# EAGLE design mcu_side (EAGLE 9.6.0)
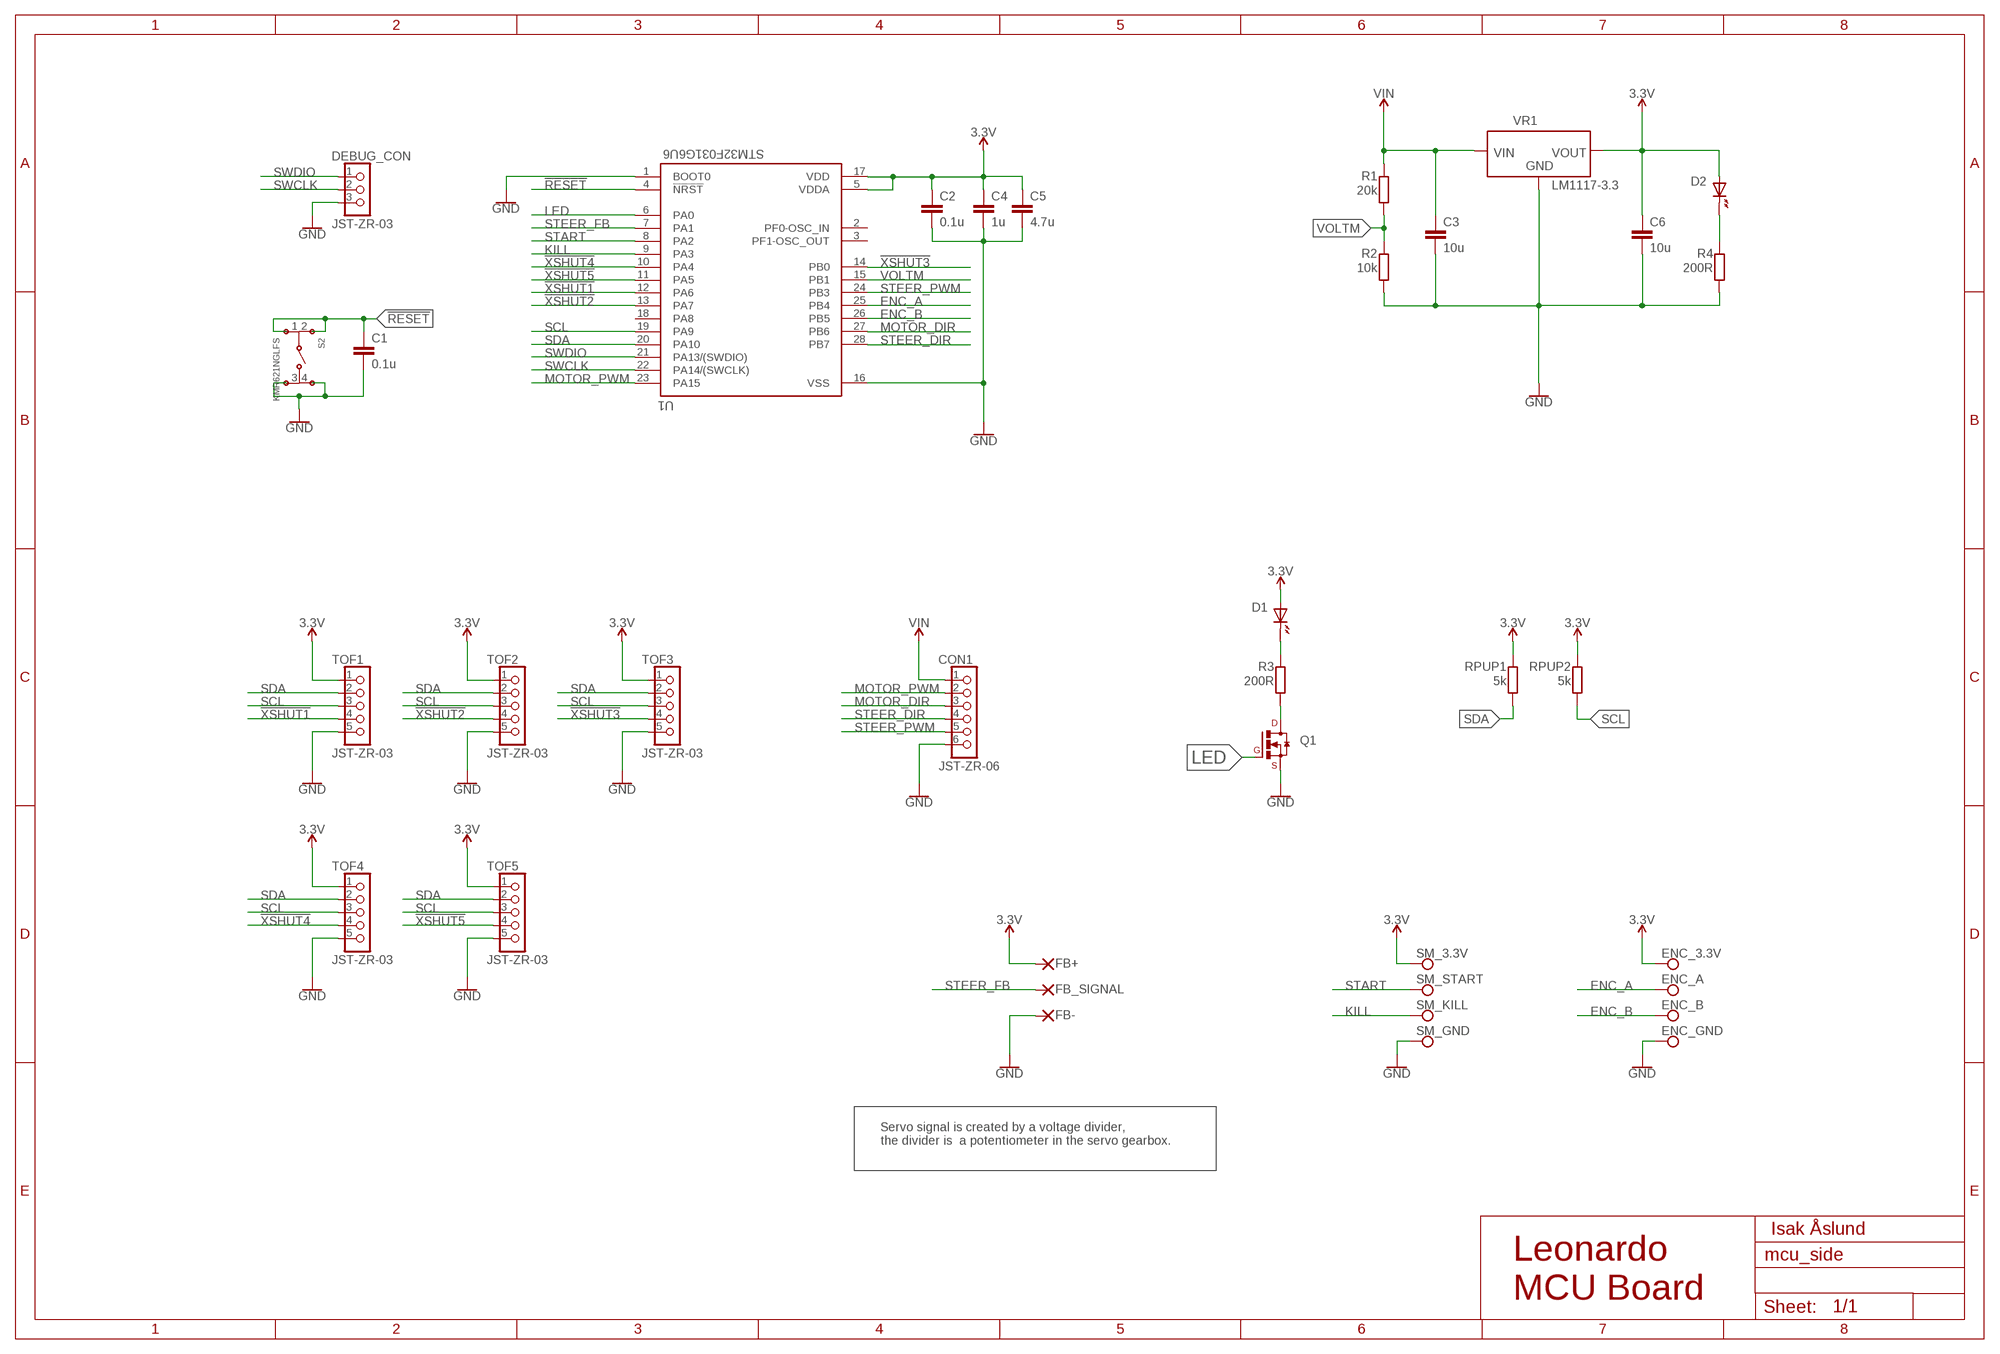
[diagram p0: schematic, sheet 1]

## Parts
C1  0.1u  C0603  [C0603]
C2  0.1u  C0603  [C0603]
C3  10u  C1206  [C1206]
C4  1u  C0603  [C0603]
C5  4.7u  C0603  [C0603]
C6  10u  C1206  [C1206]
CON1  JST-ZR-06  ZR_B6B-ZR  [B6B-ZR]
D1  CHIP-LED0603  [CHIP-LED0603]
D2  CHIP-LED0603  [CHIP-LED0603]
DEBUG_CON  JST-ZR-03  ZR_B3B-ZR  [B3B-ZR]
ENC_3.3V  PAD-SMD-ROUND-1.27PAD  [PAD.03X.05]
ENC_A  PAD-SMD-ROUND-1.27PAD  [PAD.03X.05]
ENC_B  PAD-SMD-ROUND-1.27PAD  [PAD.03X.05]
ENC_GND  PAD-SMD-ROUND-1.27PAD  [PAD.03X.05]
FB+  SMD2  [SMD1,27-2,54]
FB-  SMD2  [SMD1,27-2,54]
FB_SIGNAL  SMD2  [SMD1,27-2,54]
Q1  BSS138LT3G  [SOT23]
R1  20k  R0603  [R0603]
R2  10k  R0603  [R0603]
R3  200R  R0603  [R0603]
R4  200R  R0603  [R0603]
RPUP1  5k  R0603  [R0603]
RPUP2  5k  R0603  [R0603]
S2  KMR621NGLFS  [KMR621NGLFS]
SM_3.3V  PAD-SMD-ROUND-1.27PAD  [PAD.03X.05]
SM_GND  PAD-SMD-ROUND-1.27PAD  [PAD.03X.05]
SM_KILL  PAD-SMD-ROUND-1.27PAD  [PAD.03X.05]
SM_START  PAD-SMD-ROUND-1.27PAD  [PAD.03X.05]
TOF1  JST-ZR-03  ZR_B5B-ZR  [B5B-ZR]
TOF2  JST-ZR-03  ZR_B5B-ZR  [B5B-ZR]
TOF3  JST-ZR-03  ZR_B5B-ZR  [B5B-ZR]
TOF4  JST-ZR-03  ZR_B5B-ZR  [B5B-ZR]
TOF5  JST-ZR-03  ZR_B5B-ZR  [B5B-ZR]
U1  STM32F031G6U6  [QFN50P400X400X60-28N]
VR1  LM1117-3.3  [SOT230P700X180-4]

## Nets
3.3V: C2.1 C4.1 C5.1 C6.1 D1.A D2.A ENC_3.3V.P$1 FB+.1(P) RPUP1.1 RPUP2.1 SM_3.3V.P$1 TOF1.1 TOF2.1 TOF3.1 TOF4.1 TOF5.1 U1.5(VDDA) U1.17(VDD) VR1.2(VOUT) VR1.4(VOUT)
!RESET: C1.1 S2.1 S2.2 U1.4(!NRST)
!XSHUT1: TOF1.4 U1.12(PA6)
!XSHUT2: TOF2.4 U1.13(PA7)
!XSHUT3: TOF3.4 U1.14(PB0)
!XSHUT4: TOF4.4 U1.10(PA4)
!XSHUT5: TOF5.4 U1.11(PA5)
ENC_A: ENC_A.P$1 U1.25(PB4)
ENC_B: ENC_B.P$1 U1.26(PB5)
GND: C1.2 C2.2 C3.2 C4.2 C5.2 C6.2 CON1.6 DEBUG_CON.3 ENC_GND.P$1 FB-.1(P) Q1.2(S) R2.2 R4.2 S2.3 S2.4 SM_GND.P$1 TOF1.5 TOF2.5 TOF3.5 TOF4.5 TOF5.5 U1.1(BOOT0) U1.16(VSS) VR1.1(GND)
KILL: SM_KILL.P$1 U1.9(PA3)
LED: Q1.1(G) U1.6(PA0)
MOTOR_DIR: CON1.3 U1.27(PB6)
MOTOR_PWM: CON1.2 U1.23(PA15)
N$4: D1.C(K) R3.1
N$5: D2.C(K) R4.1
N$17: Q1.3(D) R3.2
SCL: RPUP2.2 TOF1.3 TOF2.3 TOF3.3 TOF4.3 TOF5.3 U1.19(PA9)
SDA: RPUP1.2 TOF1.2 TOF2.2 TOF3.2 TOF4.2 TOF5.2 U1.20(PA10)
START: SM_START.P$1 U1.8(PA2)
STEER_DIR: CON1.4 U1.28(PB7)
STEER_FB: FB_SIGNAL.1(P) U1.7(PA1)
STEER_PWM: CON1.5 U1.24(PB3)
SWCLK: DEBUG_CON.2 U1.22(PA14/(SWCLK))
SWDIO: DEBUG_CON.1 U1.21(PA13/(SWDIO))
VIN: C3.1 CON1.1 R1.1 VR1.3(VIN)
VOLTM: R1.2 R2.1 U1.15(PB1)
Unconnected: U1.2(PF0-OSC_IN) U1.3(PF1-OSC_OUT) U1.18(PA8)

## Notes on the sheet
- Servo signal is created by a voltage divider,
  the divider is  a potentiometer in the servo gearbox.
- Isak Åslund
- Leonardo
  MCU Board

## Library data of the parts
C1 C2 C4 C5 = CASE-RCL:C0603: Standard Chip CAPACITOR 0605 (1608 Metric) Description: Standard Chip CAPACITOR 0605 (1608 Metric)
C3 C6 = CASE-RCL:C1206: Standard Chip CAPACITOR 1206 (3216 Metric) Description: Standard Chip CAPACITOR 1206 (3216 Metric)
CON1 = CASE-JST:ZR_B6B-ZR: JST ZR Connector, through hole, 6 pin, top entry Description: JST ZR connector with 1.5 mm pitch, through hole version, 6 pin, top entry. Links: Datasheet <http://www.jst-mfg.com/product/pdf/eng/eZH.pdf>
D1 D2 = CASE-LED:CHIP-LED0603: CHIP-LED0603 (SMD) Description: Standard 0603 SMD CHIP-LED
DEBUG_CON = CASE-JST:ZR_B3B-ZR: JST ZR Connector, through hole, 3 pin, top entry Description: JST ZR connector with 1.5 mm pitch, through hole version, 3 pin, top entry. Links: Datasheet <http://www.jst-mfg.com/product/pdf/eng/eZH.pdf>
ENC_3.3V ENC_A ENC_B ENC_GND SM_3.3V SM_GND SM_KILL SM_START = Isaks Bibliotek:PAD-SMD-ROUND-1.27: SMD PAD Bare copper pad, 1.27x1.27 mm (0.05x0.05")
FB+ FB- FB_SIGNAL = wirepad:SMD2: SMD PAD
Q1 = CASE-Transistors:BSS138LT3G: BSS138LT3G N-Channel Mosfet (SOT-23) Description: BSS138LT3G N-Channel Mosfet in a SOT-23 package Links: BSS138LT3G <http://www.farnell.com/datasheets/2353875.pdf?_ga=2.38865383.510093211.1546607516-411290609.1543318711>
R1-R4 RPUP1 RPUP2 = CASE-RCL:R0603: Standard Chip RESISTOR 0603 (1608 Metric) Description: Standard Chip RESISTOR 0603 (1608 Metric)
S2 = CASE-Switches:KMR621NGLFS: C&K KMR621NG LFS Tactile SPST switch (SMD) Description: C&K KMR621NG LFS Tactile SPST switch SMD package. Links: KMR621NG LFS <http://www.farnell.com/datasheets/2706242.pdf?_ga=2.40597409.2071720333.1546461288-1112771566.1525371275>
TOF1-TOF5 = CASE-JST:ZR_B5B-ZR: JST ZR Connector, through hole, 5 pin, top entry Description: JST ZR connector with 1.5 mm pitch, through hole version, 5 pin, top entry. Links: Datasheet <http://www.jst-mfg.com/product/pdf/eng/eZH.pdf>
U1 = Isaks Bibliotek:STM32F031G6U6: Mainstream ARM Cortex-M0 Access line MCU with 32 Kbytes Flash, 48 MHz CPU, motor control; AVAILABILITY: Unavailable; DESCRIPTION: ARM® Cortex®-M0 STM32F0 Microcontroller IC 32-Bit 48MHz 32KB _32K x 8_ FLASH; MF: STMicroelectronics; MP: STM32F031G6U6; PACKAGE: UFQFN-28 STMicroelectronics; PRICE: None
VR1 = Isaks Bibliotek:LM1117-3.3: LM1117 Description: Fixed output voltage regulator Out: 3.3V, 800mA Link: Datasheet <https://datasheet.lcsc.com/szlcsc/Texas-Instruments-TI-LM1117IMPX-3-3-NOPB_C23984.pdf> LCSC.nr: C23984; IMAX: 800mA; VIN_MAX: 20; VOUT: 3.3V

## Board
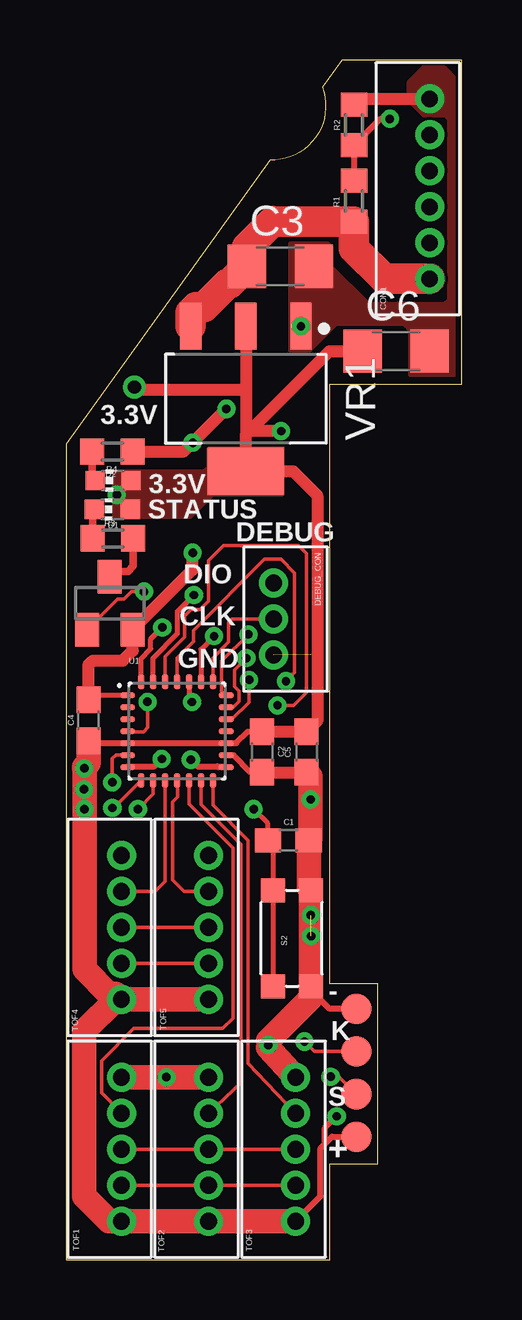
[diagram p1: board, top side]
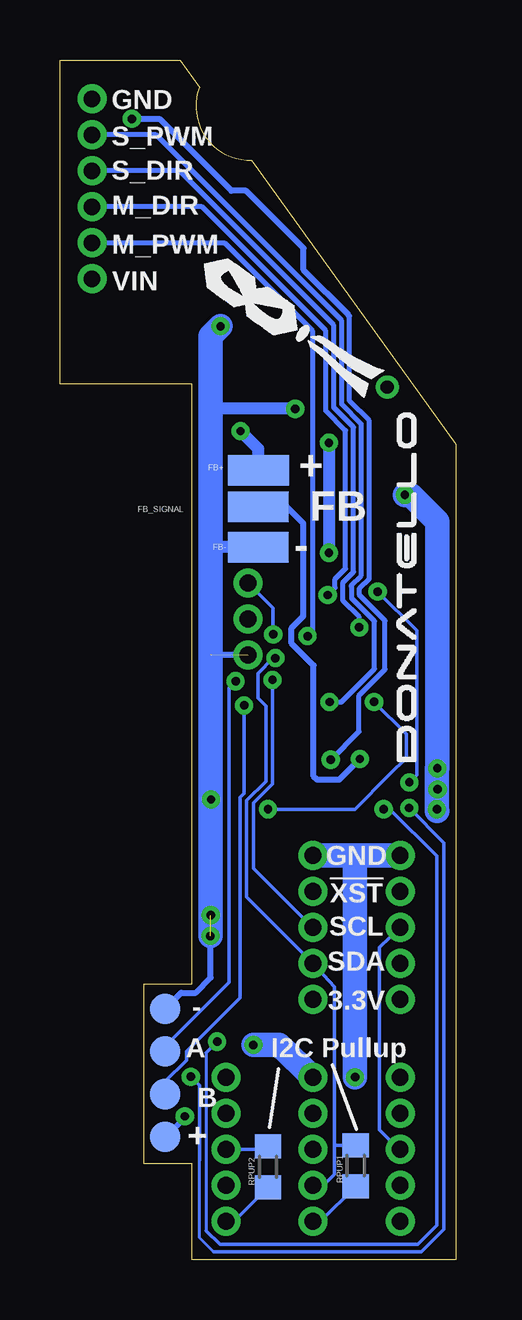
[diagram p2: board, bottom side, seen from below]

Size 16.5 x 50 mm. Coordinates in mm from the lower left corner, seen from the top.
Outline: 0,0 11,0 11,4 13,4 13,11.5 11,11.5 11,36.5 16.5,36.5 16.5,50 11.5,50 10.68,48.86 arc-113 8.5,45.83 0,34 0,0
Copper layers (1*16): Top 0.035mm / dielectric 1.5mm / Bottom 0.035mm
Design rules "default *": minimum track width 5mil, minimum drill 0.2mm, track to track 5mil, track to pad 6mil, pad to pad 6mil, via to via 6mil, smd to smd 6mil, copper to edge 10mil, drill to drill 6mil, minimum pad ring 10mil, minimum via ring 8mil, stop-mask expansion 4mil, vias tented up to drill 20mil, thermal gap 10mil

### Footprints (pad centres in the part's own frame; a part is rotated, then mirrored left to right if it is on the bottom)
C0603 = smd 1.1 x 1: 1 -0.85,0; 2 0.85,0
C1206 = smd 1.6 x 1.8: 1 -1.4,0; 2 1.4,0
B6B-ZR = drill 0.7: 1 -3.75,0; 2 -2.25,0; 3 -0.75,0; 4 0.75,0; 5 2.25,0; 6 3.75,0
CHIP-LED0603 = smd 0.8 x 0.8: A 0,-0.75; C 0,0.75
B3B-ZR = drill 0.7: 1 -1.5,0; 2 0,0; 3 1.5,0
PAD.03X.05 = smd 1.27 x 1.27: P$1 0,0
SMD1,27-2,54 = smd 1.27 x 2.54: 1 0,0
SOT23 = smd 1 x 1.4: 1 -0.95,-1.1; 2 0.95,-1.1; 3 0,1.1
R0603 = smd 1 x 1.1: 1 -0.85,0; 2 0.85,0
KMR621NGLFS = smd 1 x 1: 1 -2,-0.8; 2 2,-0.8; 3 -2,0.8; 4 2,0.8
B5B-ZR = drill 0.7: 1 -3,0; 2 -1.5,0; 3 0,0; 4 1.5,0; 5 3,0
QFN50P400X400X60-28N = smd 0.62 x 0.27: 1 -2.055,1.5; 2 -2.055,1; 3 -2.055,0.5; 4 -2.055,0; 5 -2.055,-0.5; 6 -2.055,-1; 7 -2.055,-1.5; 15 2.055,-1.5; 16 2.055,-1; 17 2.055,-0.5; 18 2.055,0; 19 2.055,0.5; 20 2.055,1; 21 2.055,1.5 | smd 0.27 x 0.62: 8 -1.5,-2.055; 9 -1,-2.055; 10 -0.5,-2.055; 11 0,-2.055; 12 0.5,-2.055; 13 1,-2.055; 14 1.5,-2.055; 22 1.5,2.055; 23 1,2.055; 24 0.5,2.055; 25 0,2.055; 26 -0.5,2.055; 27 -1,2.055; 28 -1.5,2.055
SOT230P700X180-4 = smd 1.965 x 0.889: 1 -3.023,2.3; 2 -3.023,0; 3 -3.023,-2.3 | smd 1.965 x 3.189: 4 3.023,0

### Placement (x,y rotation side)
C1  9.27,17.48 0 top
C2  8.18,21.16 270 top
C3  8.94,41.4 0 top
C4  0.94,22.48 90 top
C5  10.03,21.16 270 top
C6  13.77,37.86 0 top
CON1  15.16,44.63 90 top
D1  1.93,31.27 90 top
D2  1.96,32.47 90 top
DEBUG_CON  8.66,26.7 270 top
ENC_3.3V  12.11,5.12 0 bottom
ENC_A  12.11,8.67 0 bottom
ENC_B  12.11,6.9 0 bottom
ENC_GND  12.11,10.45 0 bottom
FB+  8.22,32.9 270 bottom
FB-  8.23,29.69 270 bottom
FB_SIGNAL  8.23,31.37 270 bottom
Q1  1.83,27.36 0 top
R1  12.01,44.12 90 top
R2  12.01,47.29 90 top
R3  1.95,30.06 0 top
R4  1.93,33.68 0 top
RPUP1  4.17,3.91 90 bottom
RPUP2  7.82,3.86 90 bottom
S2  9.42,13.39 270 top
SM_3.3V  12.1,5.12 0 top
SM_GND  12.1,10.45 0 top
SM_KILL  12.1,8.67 0 top
SM_START  12.1,6.9 0 top
TOF1  2.31,4.6 90 top
TOF2  5.94,4.6 90 top
TOF3  9.58,4.6 90 top
TOF4  2.31,13.84 90 top
TOF5  5.94,13.84 90 top
U1  4.62,22.02 0 top
VR1  7.5,35.88 270 top

### Tracks (layer width: path | path; a pad name or v marks a point on that pad's centre or on a via)
3.3V  (via drill 0.35, 0.55)
  Top 0.203: C4.1 1.05,21.52
  Top 0.254: C2.1 7.58,22.01 7.09,21.52 U1.17 U1.5 1.05,21.52 | 2.71,31.3 D1.A | TOF3.1 10.62,2.64 10.62,4.64 10.81,4.82 | 10.81,4.82 11.1,5.12 SM_3.3V.P$1 | 10.81,4.82 10.81,5.49 v11.29,5.97
  Top 0.305: D2.A v2.11,31.87 2.68,31.3 D1.A
  Top 0.508: C2.1 C5.1 10.48,22.46 10.48,31.84 9.47,32.86 VR1.4 | VR1.4 7.65,32.86 7.26,32.47 | VR1.4 7.5,34.38 | C6.1 10.98,37.86 7.65,34.53 | VR1.2 7.5,36.3 | 7.5,36.3 7.5,34.38 | v8.97,34.53 7.65,34.53 | 7.65,34.53 7.5,34.38 | 7.5,36.3 7.45,36.24 2.96,36.24 v2.85,36.36
  Top 1.016: TOF3.1 TOF2.1 TOF1.1 1.81,1.6 0.76,2.64 0.76,9.53 2.08,10.84 TOF4.1 | TOF4.1 TOF5.1 | TOF4.1 2.08,11.08 1.79,11.08 0.78,12.09 v0.78,18.77 0.78,20.46 v0.76,20.47 0.76,20.52 0.94,20.7 C4.1
  Bottom 0.152: RPUP1.1 5.63,1.6 TOF2.1 | RPUP2.1 9.24,1.6 TOF3.1 | v0.75,19.6 0.76,18.69
  Bottom 0.254: v11.29,5.97 11.29,5.93 ENC_3.3V.P$1
  Bottom 0.508: FB+.1 8.22,33.78 v8.97,34.53
  Bottom 1.016: 0.76,18.69 0.78,18.71 v0.78,18.77 0.78,20.46 v0.76,20.47 0.76,30.76 1.87,31.87 v2.11,31.87
  pour Top (no thermals): 1.95,32.88 1.95,30.93 5.22,30.93 6.15,31.86 9.03,31.86 9.09,31.92 9.09,33.84 5.94,33.84 5.91,33.81 5.91,33.06 5.73,32.88
!RESET  (via drill 0.35)
  Top 0.152: v3.4,23.24 3.4,22.17 3.23,22 2.59,22 U1.4
  Top 0.203: v7.82,18.77 8.42,18.17 C1.1 8.62,17.27 S2.1 S2.2
  Bottom 0.152: v7.82,18.77 4.19,18.77 2.75,20.21 2.06,20.9 2.06,21.9 v3.4,23.24
!XSHUT1
  Top 0.152: U1.12 5.13,19.96 5.13,18.99 6.96,17.16 6.96,10.06 6.53,9.63 2.82,9.63 1.48,8.29 1.48,6.96 TOF1.4
!XSHUT2
  Top 0.152: U1.13 5.62,18.96 7.29,17.3 7.29,7.37 TOF2.4
!XSHUT3
  Top 0.152: TOF3.4 7.59,8.18 7.59,17.48 6.12,18.95 U1.14
!XSHUT4
  Top 0.152: U1.10 4.12,15.76 3.71,15.34 TOF4.4
!XSHUT5
  Top 0.152: TOF5.4 4.93,15.34 4.45,15.83 4.45,19.07 4.65,19.28 4.65,19.94 U1.11
ENC_A  (via drill 0.35)
  Top 0.152: U1.25 4.62,25.08 5.31,25.77 5.31,26.22 8.28,29.19 8.97,29.19 9.54,28.62 9.54,24.47 v9.17,24.1
  Bottom 0.152: v9.17,24.1 9.45,23.82 9.45,11.55 12.11,8.89 ENC_A.P$1
ENC_B  (via drill 0.35)
  Top 0.152: U1.26 4.12,25.13 4.95,25.96 4.95,26.82 5.22,27.09 5.58,27.09 5.94,27.45 5.94,29.13 6.57,29.76 9.7,29.76 10.03,29.43 10.03,23.65 9.48,23.1 v8.82,23.1
  Bottom 0.152: v8.82,23.1 8.82,19.42 8.99,19.25 8.99,10.9 11.22,8.67 11.22,8.31 12.11,7.42 ENC_B.P$1
GND  (via drill 0.35)  (2 unrouted)
  Top 0.203: C4.2 1.13,23.52 U1.1
  Top 0.254: CON1.6 | U1.16 6.99,21.02 7.7,20.31 C2.2 | SM_GND.P$1 10.98,10.45 10.22,11.21
  Top 0.508: C2.2 C5.2 | 8.43,8.84 v8.43,8.94 8.43,9.12 | 10.22,10.91 10.22,11.21 S2.4 | 10.12,15.49 S2.3 | C4.2 0.94,24.79 1.12,24.97 2.36,24.97 2.78,25.39 Q1.2 5.28,28.76 v5.28,29.46 | v6.69,35.46 v5.28,34.05 4.91,33.68 R4.2 | R2.2 12.26,48.39 CON1.6
  Top 1.016: TOF3.5 8.43,8.84 | 10.22,10.91 8.43,9.12 | S2.4 v10.22,13.49 S2.3 | 10.12,15.49 C1.2 10.2,17.55 v10.2,19.18 10.2,20.14 C5.2 | TOF1.5 v4.19,7.6 TOF2.5
  Bottom 0.254: ENC_GND.P$1 11.44,11.12 10.84,11.12 10.21,11.75 v10.21,13.5 | DEBUG_CON.3 10.2,25.2 10.21,25.21
  Bottom 0.508: FB-.1 9.94,29.69 10.22,29.97 | v5.28,34.05 v5.28,29.46 | v6.69,35.46 10.18,35.46 10.21,35.43
  Bottom 1.016: v8.43,8.94 7.36,8.94 TOF2.5 | TOF4.5 4.19,16.84 | 4.19,16.84 TOF5.5 | 10.21,25.21 v10.21,13.5 v10.22,13.49 | 10.22,25.22 10.22,29.97 10.22,33.39 10.21,33.4 10.21,35.43 10.21,38.49 VR1.1 | 4.19,16.84 v4.19,7.6
  other vias: 10.21,14.35 9.8,38.9
  pour Top (no thermals): 9.33,42.36 9.33,37.89 10.17,37.89 11.28,39 14.07,39 14.34,38.73 14.34,36.87 16.32,36.87 16.35,36.9 16.35,49.14 15.78,49.71 14.91,49.71 14.28,49.08 14.28,48.3 14.91,47.67 15.81,47.67 15.96,47.52 15.96,40.02 15.78,39.84 12.63,39.84 11.1,41.37 11.1,42.18 10.92,42.36
KILL  (via drill 0.35)
  Top 0.152: U1.9 3.62,19.4 v3,18.77 | v9.94,9.08 10.35,8.67 SM_KILL.P$1
  Bottom 0.127: 10.4,8.62 10.4,1.21
  Bottom 0.152: v3,18.77 2.74,18.77 0.79,16.82 0.79,1.42 1.57,0.64 9.83,0.64 10.4,1.21 | v9.94,9.08 10.4,8.62
LED  (via drill 0.35)
  Top 0.152: Q1.1 2.15,27.53 2.42,27.53 2.73,27.84 v3.25,27.84 | v1.93,19.89 1.93,20.88 2.08,21.03 2.09,21.02 U1.6
  Bottom 0.152: v3.25,27.84 1.62,26.21 1.62,20.2 v1.93,19.89
MOTOR_DIR  (via drill 0.35)
  Top 0.203: v5.33,27.7 4.65,27.01 4.65,26.08 3.62,25.06 U1.27
  Bottom 0.203: CON1.3 10.58,43.88 5.41,38.71 5.41,35.38 4.59,34.56 4.59,28.79 5.02,28.36 5.02,28.01 v5.33,27.7
MOTOR_PWM  (via drill 0.35)
  Top 0.203: v6.17,25.99 5.62,25.44 U1.23
  Bottom 0.203: CON1.2 9.64,42.38 5.97,38.71 5.97,26.19 v6.17,25.99
N$4
  Top 0.305: R3.1 1.1,31.2 D1.C
N$5
  Top 0.305: R4.1 1.08,32.59 D2.C
N$17
  Top 0.305: Q1.3 2.05,28.68 2.58,28.68 2.8,28.9 R3.2
SCL  (via drill 0.35)
  Top 0.152: TOF1.3 TOF2.3 TOF3.3 | TOF4.3 TOF5.3 | v7.63,24.16 7.63,23.23 6.93,22.52 U1.19
  Bottom 0.152: TOF4.3 3.17,13.01 3.17,5.41 2.36,4.6 TOF1.3 | RPUP2.2 7.94,4.6 TOF3.3 | v7.63,24.16 7.63,19.82 8.43,19.02 8.43,16.31 5.96,13.84 TOF5.3
SDA  (via drill 0.35)
  Top 0.152: TOF1.2 TOF2.2 TOF3.2 | TOF4.2 TOF5.2 | U1.20 6.99,23.03 7.22,23.26 7.22,23.7 7.02,23.89 7.02,24.57 v7.51,25.07
  Bottom 0.152: 5.05,4.76 5.05,11.37 TOF5.2 8.71,15.11 8.71,19.14 7.91,19.93 7.91,23.07 8.24,23.4 8.24,24.43 7.6,25.07 v7.51,25.07 | 5.05,4.76 5.05,3.56 5.51,3.1 TOF2.2 | RPUP1.2 5.05,4.76
START  (via drill 0.35)
  Top 0.152: U1.8 1.98,18.82 v1.93,18.82 | SM_START.P$1 11.38,7.62 v11.04,7.62
  Bottom 0.127: 10.1,0.33 10.68,0.92 10.68,4.13
  Bottom 0.152: v1.93,18.82 0.48,17.37 0.48,1.27 1.42,0.33 10.1,0.33 | 10.68,4.13 10.68,7.26 v11.04,7.62
STEER_DIR  (via drill 0.35)
  Top 0.203: v4.01,26.35 3.53,25.86 3.53,25.45 3.12,25.04 U1.28
  Bottom 0.203: CON1.4 11.51,45.38 5.08,38.94 5.08,35.52 4.26,34.7 4.26,28.66 4.69,28.23 4.69,27.45 4.01,26.77 v4.01,26.35
STEER_FB  (via drill 0.35)
  Top 0.254: v3.99,20.86 3.68,20.56 2.6,20.56 U1.7
  Bottom 0.254: v3.99,20.86 4.86,19.99 5.77,19.99 5.92,20.14 5.92,24.77 6.84,25.68 6.84,26.33 6.35,26.82 6.35,30.68 7.04,31.37 FB_SIGNAL.1
STEER_PWM  (via drill 0.35)
  Top 0.203: v5.25,23.24 5.12,23.37 U1.24
  Bottom 0.203: CON1.5 12.5,46.88 4.75,39.13 4.75,35.65 3.93,34.83 3.93,28.52 4.36,28.09 4.33,28.06 4.33,27.56 3.38,26.61 3.38,24.62 4.76,23.24 v5.25,23.24
SWCLK
  Top 0.152: DEBUG_CON.2 6.92,26.7 6.78,26.55 6.78,25.73 6.12,25.08 U1.22
SWDIO  (via drill 0.35)
  Top 0.152: v7.6,26.05 6.49,24.95 6.49,23.71 U1.21
  Bottom 0.152: DEBUG_CON.1 7.62,27.15 7.62,26.07 v7.6,26.05
VIN
  Top 1.27: CON1.1 13.27,40.88 12.01,42.14 R1.1 8.66,43.27 8.64,43.29 7.54,42.19 C3.1 6.81,40.67 6.73,40.67 5.75,39.69 5.43,39.69 5.2,39.46 VR1.3
VOLTM  (via drill 0.35)
  Top 0.152: U1.15
  Top 0.254: R1.2 R2.1 13.12,47.55 v13.5,47.55 | v5.21,20.83 5.48,20.56 6.32,20.56 6.35,20.53 U1.15
  Bottom 0.203: 4.47,39.38 4.42,39.33 4.42,35.79 3.6,34.97 3.6,28.38 4,27.98 4,27.69 2.94,26.63 2.94,24.6 4.03,23.5 4.03,22.01 v5.21,20.83
  Bottom 0.254: v13.5,47.55 12.34,47.55 9.35,44.55 8.74,44.55 6.34,42.15 6.34,41.25 4.47,39.38

### Text on the board
tPlace: 3.3V | 3.3V | STATUS | DEBUG | DIO | CLK | GND | - | K | S | + | C:/Users/Isak/Downloads/Donatello_rotated.bmp
bPlace: GND | S_PWM | S_DIR | M_DIR | M_PWM | VIN | + | FB | - | GND | !XST | SCL | SDA | 3.3V | - | I2C Pullup | A | B | +